# EAGLE design CCM_0010 (EAGLE 9.0.1)

## Sheet 1 of 3: doc
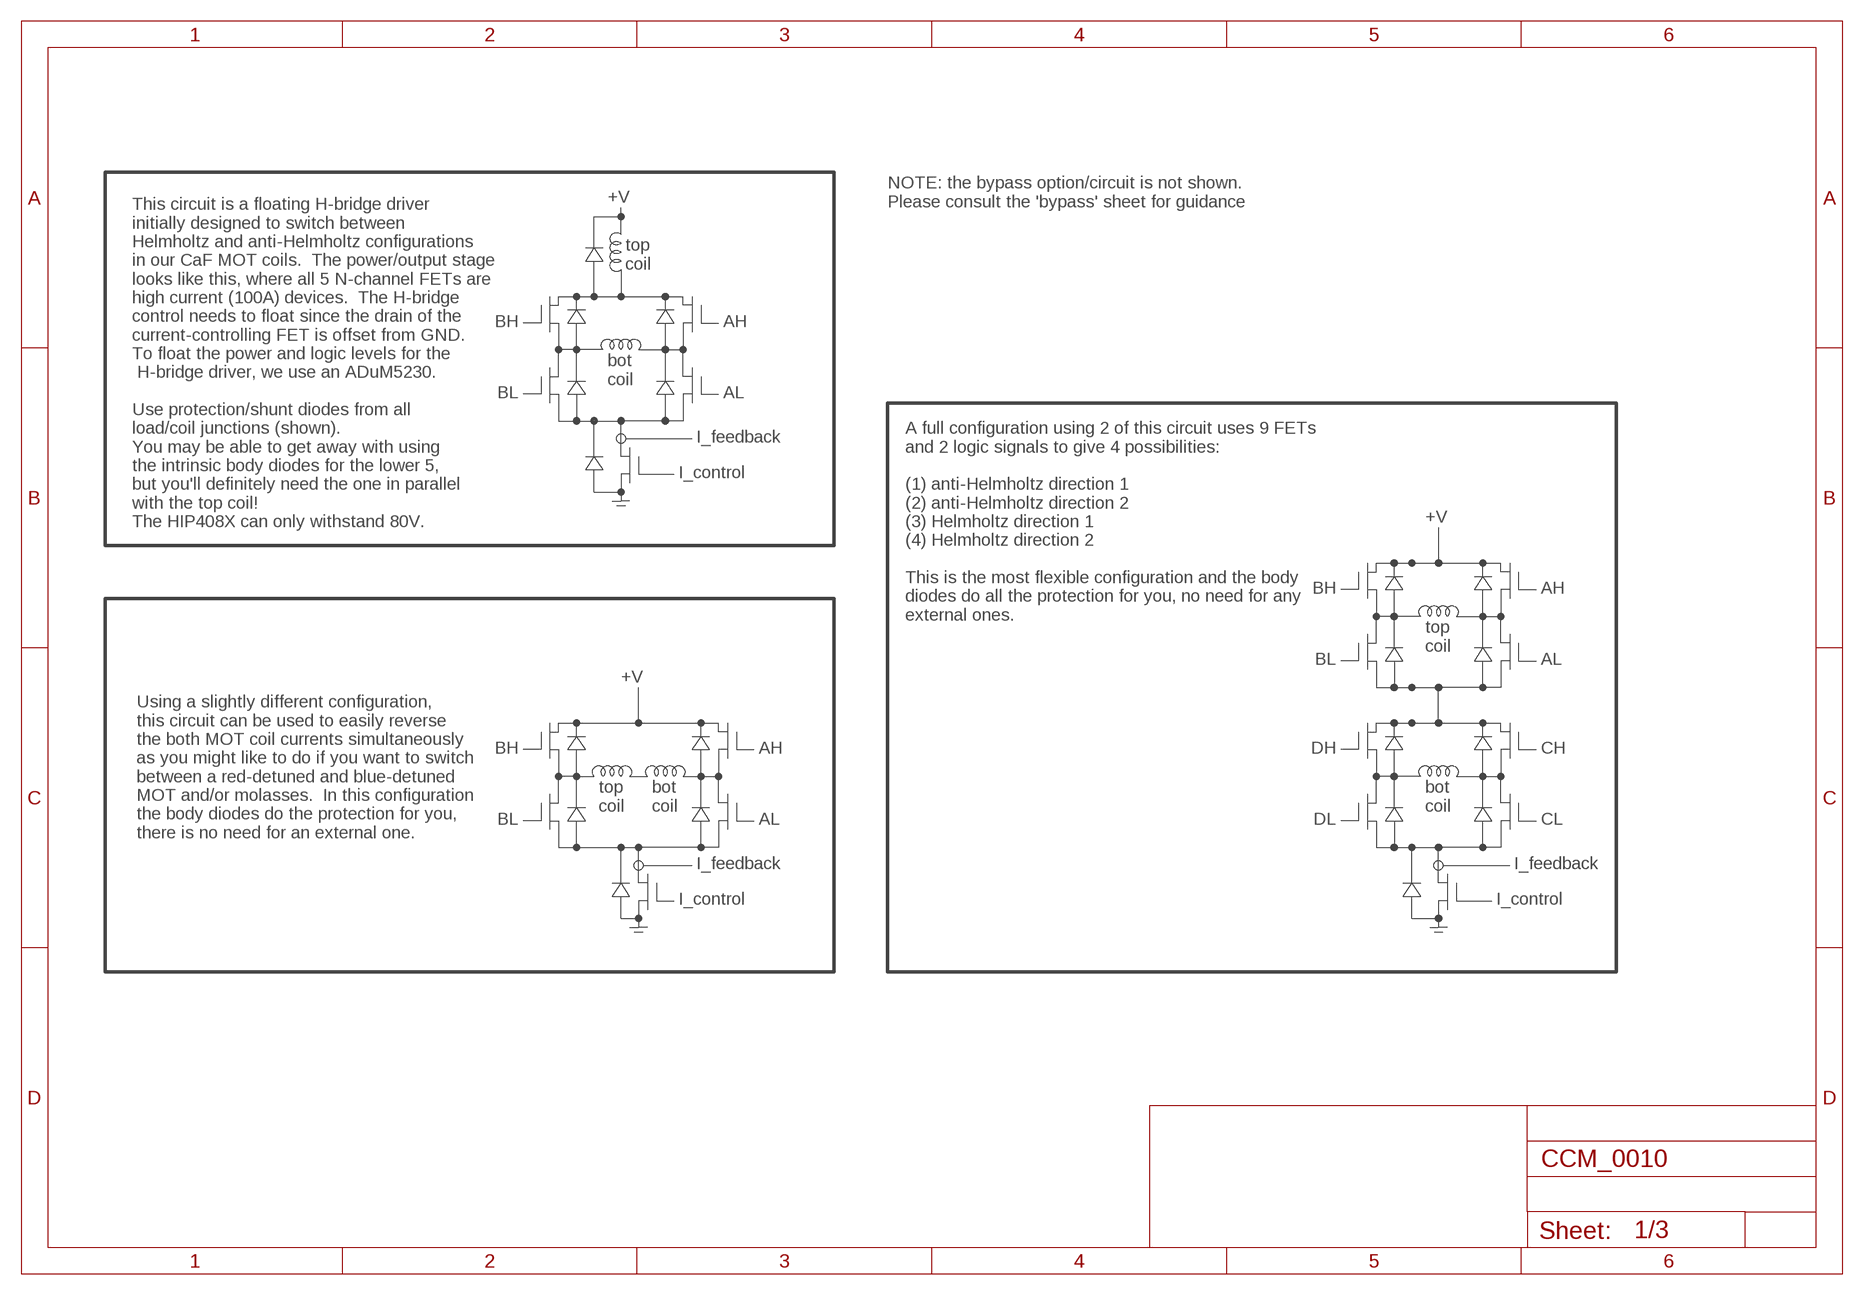
[diagram p0: schematic, sheet 1]

### Notes on the sheet
- +V
- NOTE: the bypass option/circuit is not shown.
  Please consult the 'bypass' sheet for guidance
- top 
  coil
- BH | AH
- bot 
  coil
- BL | AL
- I_feedback
- I_control
- +V
- This circuit is a floating H-bridge driver
  initially designed to switch between 
  Helmholtz and anti-Helmholtz configurations 
  in our CaF MOT coils.  The power/output stage 
  looks like this, where all 5 N-channel FETs are 
  high current (100A) devices.  The H-bridge 
  control needs to float since the drain of the 
  current-controlling FET is offset from GND.  
  To float the power and logic levels for the 
   H-bridge driver, we use an ADuM5230.
  
  Use protection/shunt diodes from all 
  load/coil junctions (shown).  
  You may be able to get away with using
  the intrinsic body diodes for the lower 5,
  but you'll definitely need the one in parallel
  with the top coil! 
  The HIP408X can only withstand 80V.
- BH | AH
- A full configuration using 2 of this circuit uses 9 FETs
  and 2 logic signals to give 4 possibilities:
  
  (1) anti-Helmholtz direction 1
  (2) anti-Helmholtz direction 2
  (3) Helmholtz direction 1
  (4) Helmholtz direction 2
  
  This is the most flexible configuration and the body
  diodes do all the protection for you, no need for any
  external ones.
- top 
  coil
- BL | AL
- +V
- BH | AH | DH | CH
- top 
  coil
- bot 
  coil
- bot 
  coil
- BL | AL | DL | CL
- Using a slightly different configuration, 
  this circuit can be used to easily reverse 
  the both MOT coil currents simultaneously 
  as you might like to do if you want to switch 
  between a red-detuned and blue-detuned 
  MOT and/or molasses.  In this configuration 
  the body diodes do the protection for you,
  there is no need for an external one.
- I_feedback | I_feedback
- I_control | I_control

## Sheet 2 of 3: h-bridge drive
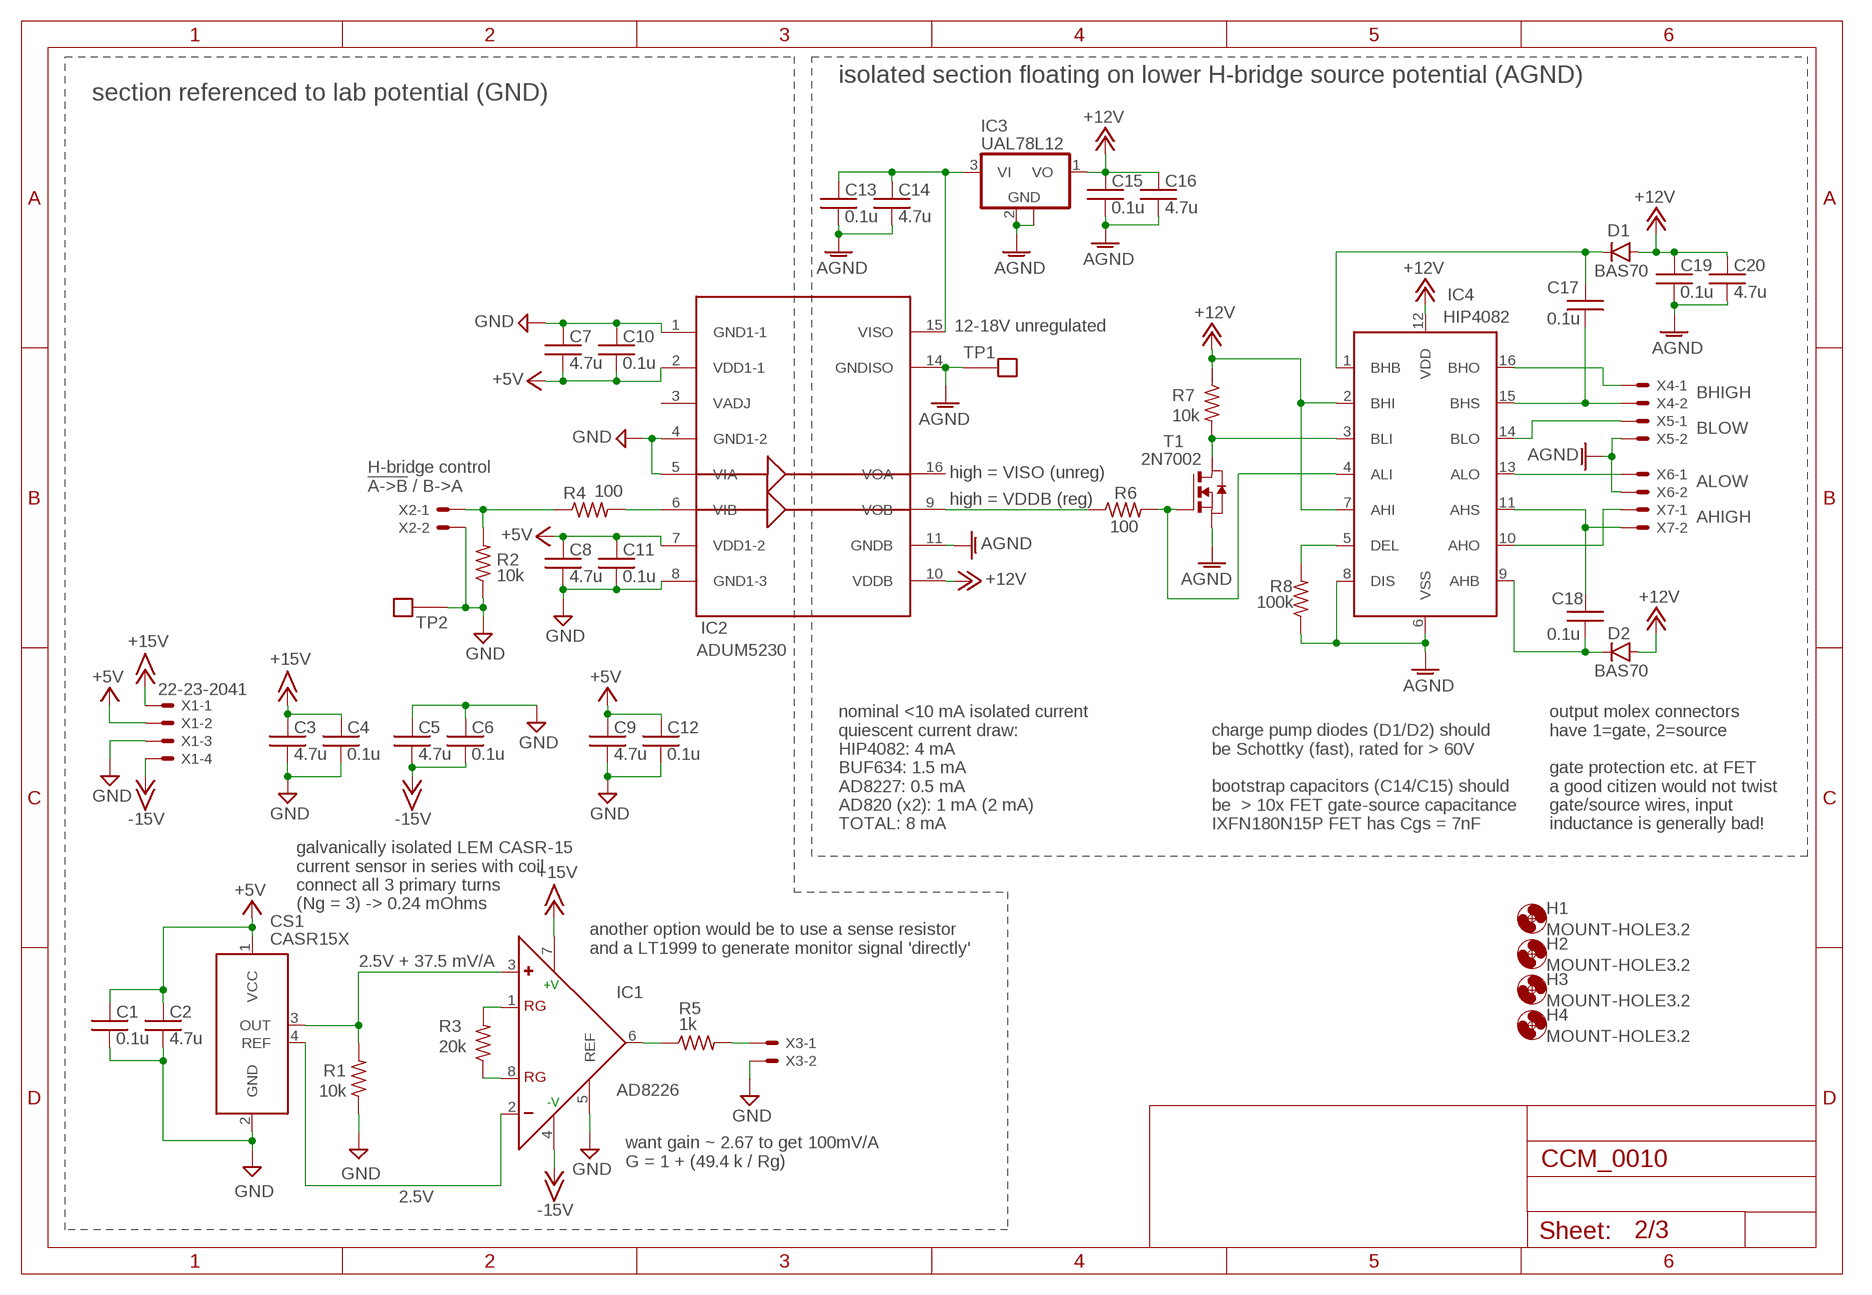
[diagram p1: schematic, sheet 2]

### Parts
C1  0.1u  C0603  [0603]
C2  4.7u  C0603  [0603]
C3  4.7u  C0603  [0603]
C4  0.1u  C0603  [0603]
C5  4.7u  C0603  [0603]
C6  0.1u  C0603  [0603]
C7  4.7u  C0603  [0603]
C8  4.7u  C0603  [0603]
C9  4.7u  C0603  [0603]
C10  0.1u  C0603  [0603]
C11  0.1u  C0603  [0603]
C12  0.1u  C0603  [0603]
C13  0.1u  C0603  [0603]
C14  4.7u  C0603  [0603]
C15  0.1u  C0603  [0603]
C16  4.7u  C0603  [0603]
C17  0.1u  C0603  [0603]
C18  0.1u  C0603  [0603]
C19  0.1u  C0603  [0603]
C20  4.7u  C0603  [0603]
CS1  CASR15X  [22-23-2041]
D1  BAS70  DIODESOT23  [SOT23-3]
D2  BAS70  DIODESOT23  [SOT23-3]
H1  MOUNT-HOLE3.2  [3,2]
H2  MOUNT-HOLE3.2  [3,2]
H3  MOUNT-HOLE3.2  [3,2]
H4  MOUNT-HOLE3.2  [3,2]
IC1  AD8226  AD620R  [SO8]
IC2  ADUM5230  [SO16W]
IC3  UAL78L12  78L12F  [SOT89]
IC4  HIP4082  [SO16]
R1  10k  R0603  [0603]
R2  10k  R0603  [0603]
R3  20k  R0603  [0603]
R4  100  R0603  [0603]
R5  1k  R0603  [0603]
R6  100  R0603  [0603]
R7  10k  R0603  [0603]
R8  100k  R0603  [0603]
T1  2N7002  NMOSSOT23  [SOT-23]
TP1  TESTPOINT  [TESTPOINT]
TP2  TESTPOINT  [TESTPOINT]
X1  22-23-2041  [22-23-2041]
X2  22-23-2021  [22-23-2021]
X3  22-23-2021  [22-23-2021]
X4  22-23-2021  [22-23-2021]
X5  22-23-2021  [22-23-2021]
X6  22-23-2021  [22-23-2021]
X7  22-23-2021  [22-23-2021]

### Nets
+5V: C1.1 C2.1 C7.2 C8.1 C9.1 C10.2 C11.1 C12.1 CS1.1(VCC) IC2.2(VDD1-1) IC2.7(VDD1-2) X1.2
+12V: C15.1 C16.1 C19.1 C20.1 D1.1(A) D2.1(A) IC2.10(VDDB) IC3.1(VO) IC4.2(BHI) IC4.7(AHI) IC4.12(VDD) R7.1 ; also sheet 3
+15V: C3.1 C4.1 IC1.7(+V) X1.1 ; also sheet 3
-15V: C5.2 C6.2 IC1.4(-V) X1.4 ; also sheet 3
AGND: C13.2 C14.2 C15.2 C16.2 C19.2 C20.2 IC2.11(GNDB) IC2.14(GNDISO) IC3.2(GND) IC3.2@1(GND) IC4.6(VSS) IC4.8(DIS) R8.1 T1.2(S) TP1.P$1 X5.2 X6.2 ; also sheet 3
GND: C1.2 C2.2 C3.2 C4.2 C5.1 C6.1 C7.1 C8.2 C9.2 C10.1 C11.2 C12.2 CS1.2(GND) IC1.5(REF) IC2.1(GND1-1) IC2.4(GND1-2) IC2.5(VIA) IC2.8(GND1-3) R1.1 R2.1 TP2.P$1 X1.3 X2.2 X3.2 ; also sheet 3
N$8: IC4.5(DEL) R8.2
N$10: C13.1 C14.1 IC2.15(VISO) IC3.3(VI)
N$13: IC2.9(VOB) R6.1
N$16: C18.2 IC4.11(AHS) X7.2
N$17: C17.2 D1.3(C) IC4.1(BHB)
N$20: C18.1 D2.3(C) IC4.9(AHB)
N$21: IC4.3(BLI) R7.2 T1.1(D)
N$22: IC4.4(ALI) R6.2 T1.3(G)
N$23: C17.1 IC4.15(BHS) X4.2
N$24: IC4.16(BHO) X4.1
N$28: R2.2 R4.1 X2.1
N$29: IC4.14(BLO) X5.1
N$30: IC2.6(VIB) R4.2
N$32: IC4.13(ALO) X6.1
N$33: IC4.10(AHO) X7.1
N$34: IC1.6(OUT) R5.1
N$35: IC1.1(RG) R3.2
N$36: IC1.8(RG) R3.1
N$37: CS1.3(OUT) IC1.3(+) R1.2
N$38: CS1.4(REF) IC1.2(-)
N$39: R5.2 X3.1
Unconnected: IC2.3(VADJ) IC2.16(VOA)

### Notes on the sheet
- isolated section floating on lower H-bridge source potential (AGND)
- section referenced to lab potential (GND)
- 12-18V unregulated
- BHIGH
- BLOW
- high = VISO (unreg)
- ALOW
- H-bridge control
  !A->B! / B->A
- high = VDDB (reg)
- AHIGH
- nominal <10 mA isolated current
  quiescent current draw: 
  HIP4082: 4 mA
  BUF634: 1.5 mA
  AD8227: 0.5 mA
  AD820 (x2): 1 mA (2 mA)
  TOTAL: 8 mA
- charge pump diodes (D1/D2) should
  be Schottky (fast), rated for > 60V
  
  bootstrap capacitors (C14/C15) should 
  be  > 10x FET gate-source capacitance
  IXFN180N15P FET has Cgs = 7nF
- output molex connectors
  have 1=gate, 2=source
  
  gate protection etc. at FET
  a good citizen would not twist 
  gate/source wires, input 
  inductance is generally bad!
- galvanically isolated LEM CASR-15
  current sensor in series with coil
  connect all 3 primary turns
  (Ng = 3) -> 0.24 mOhms
- another option would be to use a sense resistor
  and a LT1999 to generate monitor signal 'directly'
- 2.5V + 37.5 mV/A
- want gain ~ 2.67 to get 100mV/A
  G = 1 + (49.4 k / Rg)
- 2.5V

## Sheet 3 of 3: bypass
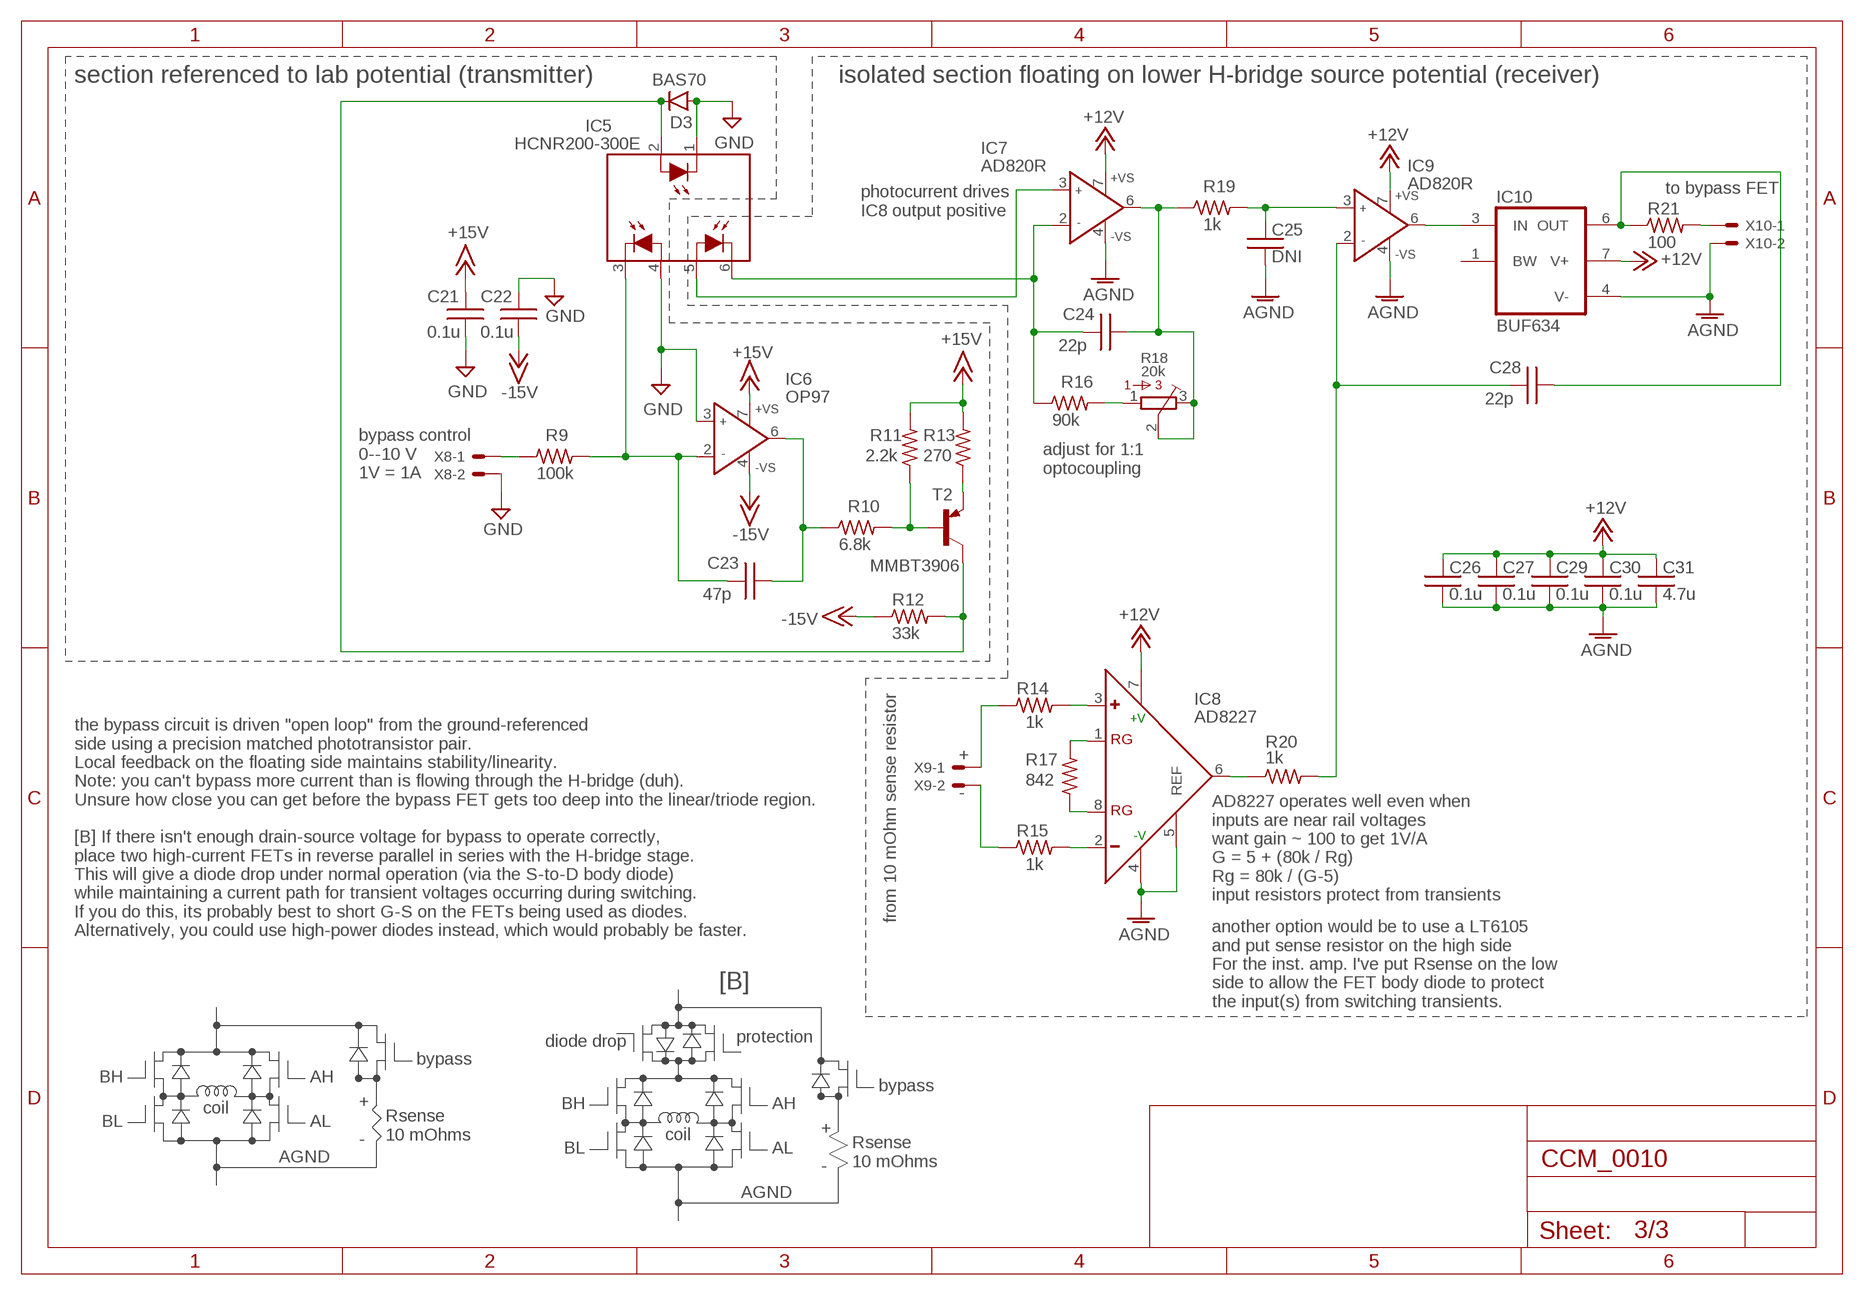
[diagram p2: schematic, sheet 3]

### Parts
C21  0.1u  C0603  [0603]
C22  0.1u  C0603  [0603]
C23  47p  C0603  [0603]
C24  22p  C0603  [0603]
C25  DNI  C0603  [0603]
C26  0.1u  C0603  [0603]
C27  0.1u  C0603  [0603]
C28  22p  C0603  [0603]
C29  0.1u  C0603  [0603]
C30  0.1u  C0603  [0603]
C31  4.7u  C0603  [0603]
D3  BAS70  DIODESOT23  [SOT23-3]
IC5  HCNR200-300E  [DIP8-400]
IC6  OP97  AD825R  [SO8]
IC7  AD820R  [SO8]
IC8  AD8227  AD620R  [SO8]
IC9  AD820R  [SO8]
IC10  BUF634  [SO8]
R9  100k  R0603  [0603]
R10  6.8k  R0603  [0603]
R11  2.2k  R0603  [0603]
R12  33k  R0603  [0603]
R13  270  R0603  [0603]
R14  1k  R0603  [0603]
R15  1k  R0603  [0603]
R16  90k  R0603  [0603]
R17  842  R0603  [0603]
R18  20k  3386-W  [3386W]
R19  1k  R0603  [0603]
R20  1k  R0603  [0603]
R21  100  R0603  [0603]
T2  MMBT3906  MMBT3906LT1-PNP-SOT23-BEC  [SOT23-BEC]
X8  22-23-2021  [22-23-2021]
X9  22-23-2021  [22-23-2021]
X10  22-23-2021  [22-23-2021]

### Nets
+12V: C26.1 C27.1 C29.1 C30.1 C31.1 IC7.7(+VS) IC8.7(+V) IC9.7(+VS) IC10.7(V+) ; also sheet 2
+15V: C21.2 IC6.7(+VS) R11.2 R13.2 ; also sheet 2
-15V: C22.1 IC6.4(-VS) R12.1 ; also sheet 2
AGND: C25.2 C26.2 C27.2 C29.2 C30.2 C31.2 IC7.4(-VS) IC8.4(-V) IC8.5(REF) IC9.4(-VS) IC10.4(V-) X10.2 ; also sheet 2
GND: C21.1 C22.2 D3.1(A) IC5.1(C) IC5.4(A1) IC6.3(IN+) X8.2 ; also sheet 2
N$3: D3.3(C) IC5.2(A) R12.2 T2.C
N$4: C24.1 IC7.6(OUT) R18.2 R18.3 R19.1
N$7: R9.1 X8.1
N$9: C23.2 IC5.3(C1) IC6.2(IN-) R9.2
N$11: R16.2 R18.1
N$12: C23.1 IC6.6(OUT) R10.1
N$14: R10.2 R11.1 T2.B
N$15: R13.1 T2.E
N$18: C24.2 IC5.6(C2) IC7.2(IN-) R16.1
N$19: IC5.5(A2) IC7.3(IN+)
N$25: IC9.6(OUT) IC10.3(IN)
N$26: C28.1 IC10.6(OUT) R21.1
N$27: R21.2 X10.1
N$31: C28.2 IC9.2(IN-) R20.2
N$40: IC8.6(OUT) R20.1
N$41: IC8.1(RG) R17.2
N$42: IC8.8(RG) R17.1
N$43: C25.1 IC9.3(IN+) R19.2
N$44: R14.1 X9.1
N$45: R15.1 X9.2
N$46: IC8.2(-) R15.2
N$47: IC8.3(+) R14.2
Unconnected: IC10.1(BW)

### Notes on the sheet
- section referenced to lab potential (transmitter) | isolated section floating on lower H-bridge source potential (receiver)
- to bypass FET
- photocurrent drives 
  IC8 output positive
- adjust for 1:1 
  optocoupling
- bypass control
  0--10 V
  1V = 1A
- +
  
  -
- AD8227 operates well even when 
  inputs are near rail voltages
  want gain ~ 100 to get 1V/A
  G = 5 + (80k / Rg)
  Rg = 80k / (G-5)
  input resistors protect from transients
- from 10 mOhm sense resistor
- the bypass circuit is driven "open loop" from the ground-referenced
  side using a precision matched phototransistor pair.  
  Local feedback on the floating side maintains stability/linearity.
  Note: you can't bypass more current than is flowing through the H-bridge (duh).
  Unsure how close you can get before the bypass FET gets too deep into the linear/triode region.
  
  [B] If there isn't enough drain-source voltage for bypass to operate correctly,
  place two high-current FETs in reverse parallel in series with the H-bridge stage.
  This will give a diode drop under normal operation (via the S-to-D body diode)
  while maintaining a current path for transient voltages occurring during switching.
  If you do this, its probably best to short G-S on the FETs being used as diodes.
  Alternatively, you could use high-power diodes instead, which would probably be faster.
- [B]
- another option would be to use a LT6105
  and put sense resistor on the high side
  For the inst. amp. I've put Rsense on the low 
  side to allow the FET body diode to protect 
  the input(s) from switching transients.
- diode drop | protection
- bypass
- BH | AH
- bypass
- coil | BH | AH
- BL | AL
- Rsense
  10 mOhms
- coil
- +
  
  -
- BL | AL
- AGND
- Rsense
  10 mOhms
- +
  
  -
- AGND

## Library data of the parts
C1-C31 = acrooptics:C: Capacitor
CS1 = noah:CASR15
D1-D3 = WCSMain:DIODE: Diode These are standard reverse protection diodes and small signal diodes. SMA package can handle up to about 1A. SOD-323 can handle about 200mA. What the SOD-323 package when ordering, there are some mfgs out there that are 5-pin packages.
H1-H4 = holes:MOUNT-HOLE: MOUNTING HOLE with drill center marker
IC1 IC8 = analog-devices:AD620: Low Cost, Low Power, Instrumentation Amplifier Source: http://www.analog.com/UploadedFiles/Data_Sheets/37793330023930AD620_e.pdf; MPN: AD620AR; OC_FARNELL: 1464424; OC_NEWARK: 05F7109
IC2 = noah:ADUM5230
IC3 = linear:78L*: POSITOIV-VOLTAGE REGULATORS Output up to 100 mA Source: Datasheet <http://focus.ti.com/lit/ds/symlink/ua78l05.pdf>
IC4 = noah:HIP4082
IC5 = avago:HCNR20*: High-Linearity Analog Optocouplers Source: AV02-0886EN+DS+HCNR200+10Dec2011.pdf
IC6 = analog-devices:AD825: Low Cost, General-Purpose High Speed JFET Amplifier Source: http://www.analog.com/static/imported-files/data_sheets/AD825.pdf; MF: ALTERA CORPORATION; MPN: AD825ARZ; OC_FARNELL: 9603735; OC_NEWARK: 59K6528
IC7 IC9 = analog-devices:AD820: Single-Supply, Rail-to-Rail, Low Power, FET Input Op Amp Source: http://www.analog.com/static/imported-files/data_sheets/AD820.pdf; OC_FARNELL: 1838867; OC_NEWARK: unknown
IC10 = noah:BUF634: 250mA High-Speed Buffer
R1-R17 R19-R21 = acrooptics:R: 0603 resistor
R18 = bourns:3386-: 3386 Series 3/8" Square Trimmer
T1 = zetex:NMOSSOT23: MOS FET; OC_FARNELL: unknown; OC_NEWARK: unknown
T2 = transistor:*-PNP-: PNP Transistror
TP1 TP2 = noah:TESTPOINT
X1 = con-molex:22-23-2041: .100" (2.54mm) Center Header - 4 Pin; MF: MOLEX; MPN: 22-23-2041; OC_FARNELL: 1462920; OC_NEWARK: 38C0355
X2-X10 = con-molex:22-23-2021: .100" (2.54mm) Center Header - 2 Pin; MF: MOLEX; MPN: 22-23-2021; OC_FARNELL: 1462926; OC_NEWARK: 25C3832

## Net classes
1 standard: width 0.61 mm, clearance 0.254 mm

## Board
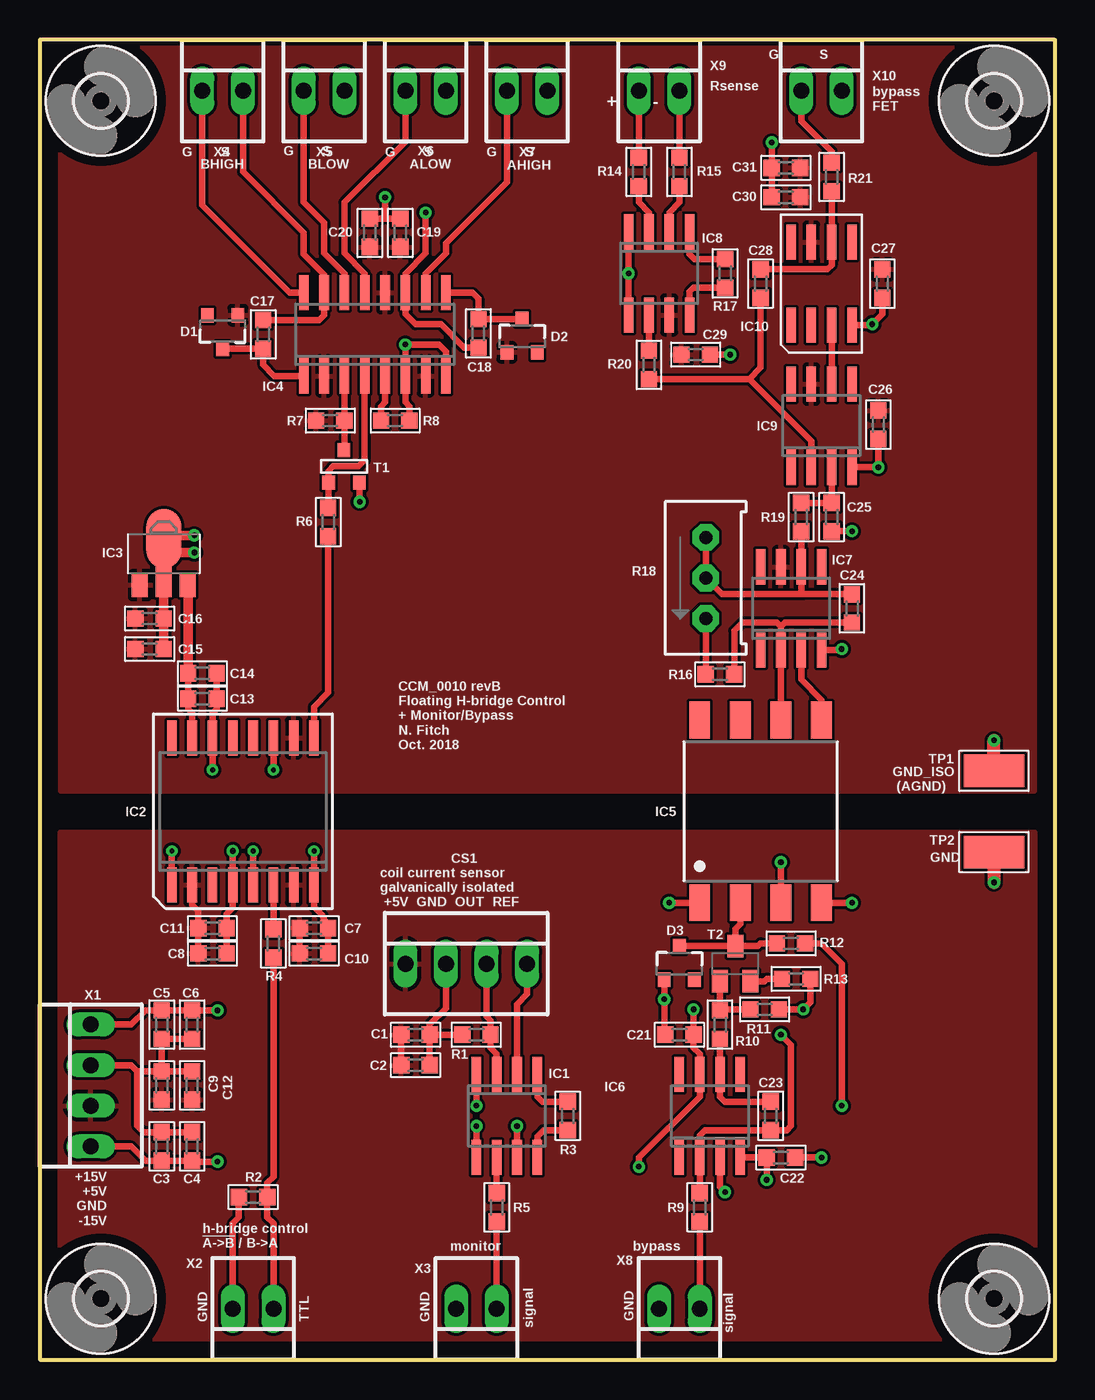
[diagram p3: board, top side]
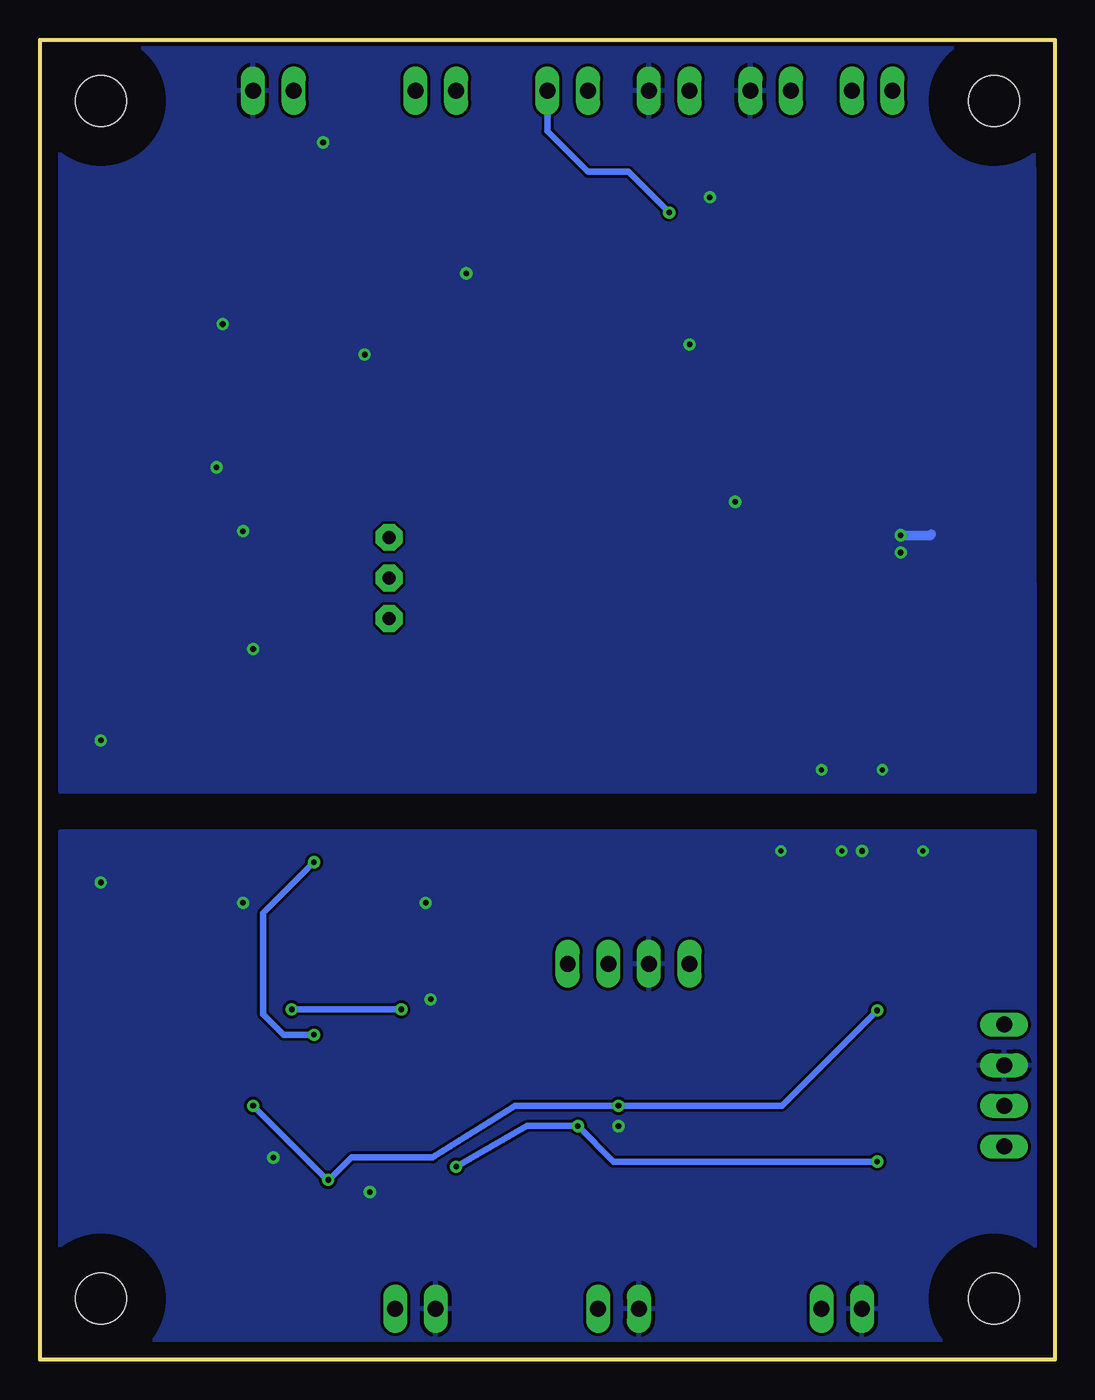
[diagram p4: board, bottom side, seen from below]

Size 63.5 x 82.55 mm. Coordinates in mm from the lower left corner, seen from the top.
Outline: 0,0 63.5,0 63.5,82.55 0,82.55 0,0
Copper layers (1*16): Top 0.035mm / dielectric 1.5mm / Bottom 0.035mm
Design rules "default *": minimum track width 10mil, minimum drill 10mil, track to track 7mil, track to pad 7mil, pad to pad 7mil, via to via 7mil, smd to smd 7mil, copper to edge 10mil, drill to drill 8mil, minimum pad ring 10mil, minimum via ring 8mil, stop-mask expansion 4mil, vias tented up to drill 0mil, thermal gap 10mil

### Footprints (pad centres in the part's own frame; a part is rotated, then mirrored left to right if it is on the bottom)
0603 = smd 1.016 x 1.016: 1 -0.889,0; 2 0.889,0
22-23-2041 = drill 1 long: 1 -3.81,0; 2 -1.27,0; 3 1.27,0; 4 3.81,0
SOT23-3 = smd 0.8 x 0.9: 1 -0.95,-1; 2 0.95,-1; 3 0,1.1
3,2 = hole 3.2: 0,0
SO8 = smd 0.6 x 2.2: 1 -1.905,-2.6; 2 -0.635,-2.6; 3 0.635,-2.6; 4 1.905,-2.6; 5 1.905,2.6; 6 0.635,2.6; 7 -0.635,2.6; 8 -1.905,2.6
SO16W = smd 0.6 x 2.2: 1 -4.445,-4.6; 2 -3.175,-4.6; 3 -1.905,-4.6; 4 -0.635,-4.6; 5 0.635,-4.6; 6 1.905,-4.6; 7 3.175,-4.6; 8 4.445,-4.6; 9 4.445,4.6; 10 3.175,4.6; 11 1.905,4.6; 12 0.635,4.6; 13 -0.635,4.6; 14 -1.905,4.6; 15 -3.175,4.6; 16 -4.445,4.6
SOT89 = smd 1 x 1.5: 1 -1.499,-1.981; 3 1.499,-1.981 | smd 1 x 2: 2 0,-1.727 | smd 2.2 x 3.7: 2@1 0,0.94
SO16 = smd 0.6 x 2.2: 1 -4.445,-2.6; 2 -3.175,-2.6; 3 -1.905,-2.6; 4 -0.635,-2.6; 5 0.635,-2.6; 6 1.905,-2.6; 7 3.175,-2.6; 8 4.445,-2.6; 9 4.445,2.6; 10 3.175,2.6; 11 1.905,2.6; 12 0.635,2.6; 13 -0.635,2.6; 14 -1.905,2.6; 15 -3.175,2.6; 16 -4.445,2.6
DIP8-400 = smd 1.3 x 2.29: 1 -3.81,-5.72; 2 -1.27,-5.72; 3 1.27,-5.72; 4 3.81,-5.72; 5 3.81,5.72; 6 1.27,5.72; 7 -1.27,5.72; 8 -3.81,5.72
3386W = drill 0.813 pad 1.676 octagon: 1 2.54,0.318; 2 0,0.318; 3 -2.54,0.318
SOT-23 = smd 0.787 x 0.889: 1 0.025,-1.016; 2 -0.94,1.016; 3 0.991,1.016
SOT23-BEC = smd 1 x 1.4: B -0.95,-1.1; C 0,1.1; E 0.95,-1.1
TESTPOINT = smd 3.81 x 2.032: P$1 0,0
22-23-2021 = drill 1 long: 1 -1.27,0; 2 1.27,0

### Placement (x,y rotation side)
C1  23.5,20.32 0 top
C2  23.5,18.41 0 top
C3  7.62,13.34 90 top
C4  9.53,13.34 90 top
C5  7.62,20.95 90 top
C6  9.53,20.95 90 top
C7  17.14,26.99 180 top
C8  10.79,25.4 0 top
C9  7.62,17.14 90 top
C10  17.14,25.4 180 top
C11  10.79,26.99 0 top
C12  9.53,17.14 90 top
C13  10.16,41.34 0 top
C14  10.16,42.93 0 top
C15  6.86,44.45 0 top
C16  6.86,46.35 0 top
C17  13.97,64.14 270 top
C18  27.43,64.2 270 top
C19  22.54,70.48 90 top
C20  20.64,70.48 90 top
C21  40.01,20.32 0 top
C22  46.35,12.64 0 top
C23  45.72,15.24 270 top
C24  50.8,46.99 270 top
C25  49.53,52.7 270 top
C26  52.45,58.48 270 top
C27  52.7,67.31 270 top
C28  45.09,67.31 270 top
C29  41.02,62.87 0 top
C30  46.67,72.71 180 top
C31  46.67,74.55 180 top
CS1  26.67,24.77 0 top
D1  11.43,64.33 180 top
D2  30.16,64.01 0 top
D3  40.01,24.77 0 top
H1  3.81,3.81 0 top
H2  59.69,3.81 0 top
H3  3.81,78.74 0 top
H4  59.69,78.74 0 top
IC1  29.21,15.24 180 top
IC2  12.7,34.29 0 top
IC3  7.75,50.42 0 top
IC4  20.95,64.14 0 top
IC5  45.09,34.29 0 top
IC6  41.91,15.24 0 top
IC7  46.99,46.99 0 top
IC8  38.73,67.94 180 top
IC9  48.9,58.42 0 top
IC10  48.9,67.31 0 top
R1  27.3,20.32 0 top
R2  13.34,10.16 0 top
R3  33.02,15.24 90 top
R4  14.61,26.04 90 top
R5  28.57,9.53 270 top
R6  18.03,52.39 90 top
R7  18.16,58.74 0 top
R8  22.23,58.74 180 top
R9  41.27,9.53 90 top
R10  42.55,20.95 90 top
R11  45.34,21.91 0 top
R12  46.99,26.04 180 top
R13  47.31,23.81 0 top
R14  37.47,74.3 270 top
R15  40.01,74.3 270 top
R16  42.55,42.86 180 top
R17  42.86,67.94 90 top
R18  41.34,48.9 270 top
R19  47.62,52.7 90 top
R20  38.1,62.23 270 top
R21  49.53,73.98 90 top
T1  19.05,55.88 180 top
T2  43.5,24.77 0 top
TP1  59.69,36.83 180 top
TP2  59.69,31.75 0 top
X1  3.17,17.14 90 top
X2  13.34,3.17 180 top
X3  27.3,3.17 180 top
X4  11.43,79.38 0 top
X5  17.78,79.38 0 top
X6  24.13,79.38 0 top
X7  30.48,79.38 0 top
X8  40.01,3.17 180 top
X9  38.73,79.38 0 top
X10  48.9,79.38 0 top

### Tracks (layer width: path | path; a pad name or v marks a point on that pad's centre or on a via)
+5V
  Top 0.406: IC2.2 9.53,28.45 9.91,28.07 C11.1 C8.1 | C7.2 C10.2 | C1.1 C2.1
  pour Top: 1.27,1.27 1.27,33.02 62.23,33.02 62.23,1.27
+12V
  pour Top: 62.23,87.63 1.27,87.63 1.27,35.56 62.23,35.56
+15V  (via drill 0.35)
  Top 0.406: X1.1 5.71,13.34 6.6,12.45 C3.1 C4.1 9.59,12.38 v11.11,12.38 | v29.84,14.61 IC1.7 | R11.2 v47.75,21.91 48.2,22.35 R13.2 | v40.89,21.91 C21.2 40.89,19.49 41.27,19.11 IC6.7 41.27,16.45 37.47,12.64 v37.47,12.06
  Bottom 0.406: v40.89,21.91 v47.75,21.91 | v11.11,12.38 27.62,12.38 v29.84,14.61 33.02,14.61 v37.47,12.06
-15V  (via drill 0.35)
  Top 0.406: X1.4 5.71,20.95 6.6,21.84 C5.2 C6.2 v11.11,21.84 | v27.3,15.88 IC1.4 | IC6.4 C22.1 v45.47,11.24 | R12.1 48.9,26.04 50.16,24.77 v50.16,15.88
  Bottom 0.406: v50.16,15.88 45.47,11.18 | 45.47,11.18 v45.47,11.24 | v11.11,21.84 17.08,15.88 v27.3,15.88 33.78,15.88 38.92,12.64 44.01,12.64 45.47,11.18
AGND  (via drill 0.3, 0.35)
  Top 0.406: v14.61,36.89 IC2.11 | v10.79,36.89 IC2.14 10.79,40.45 11.05,40.7 C13.2 C14.2 | C19.2 21.59,71.37 | 21.59,71.37 C20.2 | v21.59,72.71 21.59,71.37 | IC7.4 50.1,44.39 v50.16,44.45 | C25.2 v50.8,51.82 | C30.2 C31.2 v45.78,76.14 | IC8.4 v36.83,67.94 IC8.5 | IC9.4 v52.45,55.82 | v52.45,55.82 | C26.2 v52.45,55.82 | IC10.4 52.01,64.71 v52.07,64.77 52.7,65.41 C27.2 | C29.2 v43.18,62.87 | R8.1 23.11,59.63 22.86,59.88 IC4.6 v22.86,63.5 24.96,63.5 25.4,63.06 IC4.8 | T1.2 v19.99,53.67 v20,53.66
  Top 0.61: IC3.2@1 IC3.2 C16.2 C15.2 | IC3.2@1 8.62,50.48 v9.65,50.48 | IC3.2@1 7.95,51.56 v9.65,51.56
  Top 0.813: TP1.P$1 v59.69,38.73
  Bottom 0.61: v9.65,51.56 7.81,51.56 7.75,51.63
  pour Bottom: 1.27,35.56 1.33,87.63 62.23,87.63 62.23,35.56
GND  (via drill 0.3, 0.35)
  Top 0.406: IC2.5 v13.34,31.81 | v17.14,31.81 IC2.8 17.14,28.32 17.65,27.81 C7.1 C10.1 | IC2.1 v8.26,31.81 | C8.2 C11.2 11.68,27.88 12.06,28.26 IC2.4 v12.06,31.81 | C1.2 C2.2 | CS1.2 25.4,21.97 24.38,20.95 C1.2 | R1.1 C1.2 | C12.2 C9.2 | C9.2 6.1,18.03 | 6.1,18.03 5.71,18.41 X1.3 | C6.1 C5.1 C9.2 | X2.2 12.06,8.51 12.45,8.89 R2.1 | C4.2 C3.2 6.48,14.22 6.1,14.61 6.1,18.03 | IC1.5 v27.3,14.61 | IC6.3 42.55,10.79 v42.86,10.48 | IC5.1 v39.38,28.57 v39.37,28.57 | D3.1 v39.05,22.55 | v39.05,22.55 v39.05,22.54 | IC5.4 v50.8,28.57 | C21.1 39.05,20.32 v39.05,22.55 | C22.2 v48.9,12.64
  Top 0.813: TP2.P$1 v59.69,29.84
  pour Bottom: 1.27,1.27 1.27,33.02 62.23,33.02 62.23,1.27
N$3
  Top 0.406: T2.C 44.91,25.86 45.09,26.04 R12.2 | T2.C D3.3 | IC5.2 43.81,27.24 43.5,26.92 T2.C
N$4
  Top 0.406: C24.1 47.75,47.88 | 47.75,47.88 47.62,48.01 IC7.6 R19.1 | 47.75,47.88 42.67,47.88 R18.2 R18.3
N$7
  Top 0.406: R9.1 X8.1
N$8
  Top 0.406: R8.2 21.34,59.63 21.59,59.88 IC4.5
N$9  (via drill 0.35)
  Top 0.406: R9.2 IC6.2 41.27,14.03 41.59,14.35 C23.2 46.74,14.35 46.99,14.61 46.99,19.68 v46.35,20.32 | v46.35,31.11 IC5.3
  Bottom 0.406: v46.35,20.32 48.26,20.32 49.53,21.59 49.53,27.94 v46.35,31.11
N$10
  Top 0.406: C13.1 C14.1 | IC2.15 9.53,40.45 9.27,40.7 C13.1 | 9.26,41.33 C13.1
  Top 0.61: IC3.3 9.27,48.41 C14.1
N$11
  Top 0.406: R16.2 R18.1
N$12
  Top 0.406: C23.1 42.86,16.13 42.55,16.45 IC6.6 R10.1
N$13
  Top 0.406: 18.03,51.82 R6.1 18.03,41.72 17.14,40.83 IC2.9
N$14
  Top 0.406: T2.B R10.2 42.61,21.91 R11.1
N$15
  Top 0.406: T2.E 45.32,23.66 45.47,23.81 R13.1
N$16  (via drill 0.35)
  Top 0.406: C18.2 26.54,63.31 25.08,64.77 23.5,64.77 22.86,65.41 IC4.11 22.86,67.94 24.13,69.22 v24.13,71.75
  Bottom 0.406: X7.2 31.75,76.83 29.21,74.3 26.67,74.3 v24.13,71.75
N$17
  Top 0.406: D1.3 11.45,63.25 C17.2 13.97,62.23 14.66,61.53 IC4.1
N$18
  Top 0.406: IC5.6 IC7.2 46.35,45.85 | C24.2 46.61,46.1 46.35,45.85 | 46.35,45.85 46.1,46.1 43.94,46.1 43.43,45.59 R16.1
N$19
  Top 0.406: IC5.5 48.9,41.27 47.62,42.55 IC7.3
N$20
  Top 0.406: D2.3 30.14,65.09 C18.1 27.43,66.36 27.05,66.73 IC4.9
N$21
  Top 0.406: IC4.3 R7.2 19.05,56.92 T1.1
N$22
  Top 0.406: R6.2 18.06,53.3 T1.3 18.06,55.59 18.35,55.88 19.94,55.88 20.32,56.26 IC4.4
N$23
  Top 0.406: C17.1 17.46,65.02 17.78,65.34 IC4.15 17.78,67.88 16.51,69.15 16.51,70.48 12.7,74.3 X4.2
N$24
  Top 0.406: X4.1 10.16,72.2 15.62,66.73 IC4.16
N$25
  Top 0.406: IC10.3 IC9.6
N$26
  Top 0.406: R21.1 IC10.6 49.53,68.45 49.28,68.2 C28.1
N$27
  Top 0.406: R21.2 49.53,75.56 47.62,77.47 X10.1
N$28
  Top 0.406: X2.1 14.61,8.51 14.22,8.89 R2.2 14.22,11.05 14.61,11.43 R4.1
N$29
  Top 0.406: IC4.14 19.05,67.94 17.78,69.22 17.78,71.12 16.51,72.39 X5.1
N$30
  Top 0.406: IC2.6 R4.2
N$31
  Top 0.406: R20.2 44.39,61.34 | 44.39,61.34 48.26,57.47 IC9.2 | C28.2 45.09,62.04 44.39,61.34
N$32
  Top 0.406: IC4.13 20.32,67.94 19.05,69.22 19.05,72.39 22.86,76.2 X6.1
N$33
  Top 0.406: IC4.10 24.13,67.94 25.4,69.22 25.4,69.85 29.21,73.66 X7.1
N$34
  Top 0.406: IC1.6 R5.1
N$35
  Top 0.406: R3.2 31.43,16.13 31.11,16.45 IC1.1
N$36
  Top 0.406: R3.1 31.5,14.35 31.11,13.97 IC1.8
N$37
  Top 0.406: CS1.3 27.94,21.46 28.19,21.21 R1.2 28.19,19.49 28.57,19.11 IC1.3
N$38
  Top 0.406: CS1.4 30.48,22.86 29.84,22.23 IC1.2
N$39
  Top 0.406: R5.2 X3.1
N$40
  Top 0.406: IC8.6 R20.1
N$41
  Top 0.406: IC8.1 40.64,69.15 40.96,68.83 R17.2
N$42
  Top 0.406: IC8.8 40.64,66.8 40.89,67.06 R17.1
N$43
  Top 0.406: R19.2 C25.1 IC9.3
N$44
  Top 0.406: X9.1 R14.1
N$45
  Top 0.406: X9.2 R15.1
N$46
  Top 0.406: IC8.2 39.37,71.75 40.01,72.39 R15.2
N$47
  Top 0.406: IC8.3 38.1,71.75 37.47,72.39 R14.2

### Text on the board
tPlace: G S | Rsense | + - | bypass / FET | G S | G S | G S | G S | BHIGH | BLOW | ALOW | AHIGH | CCM_0010 revB / Floating H-bridge Control / + Monitor/Bypass / N. Fitch / Oct. 2018 | GND_ISO / (AGND) | GND | coil current sensor / galvanically isolated / +5V GND OUT REF | +15V / +5V / GND / -15V | h-bridge control / !A->B! / B->A | monitor | bypass | GND | TTL | GND | signal | GND | signal